# EasyEDA schematic UVsensor (Solarbetrieb).json
TITLE: UVsensor (Solarbetrieb); REV: 0.4; Date: 2019-06-29; Sheet: 1/1; Drawn By: Stefan Burkhardt; Company: Private
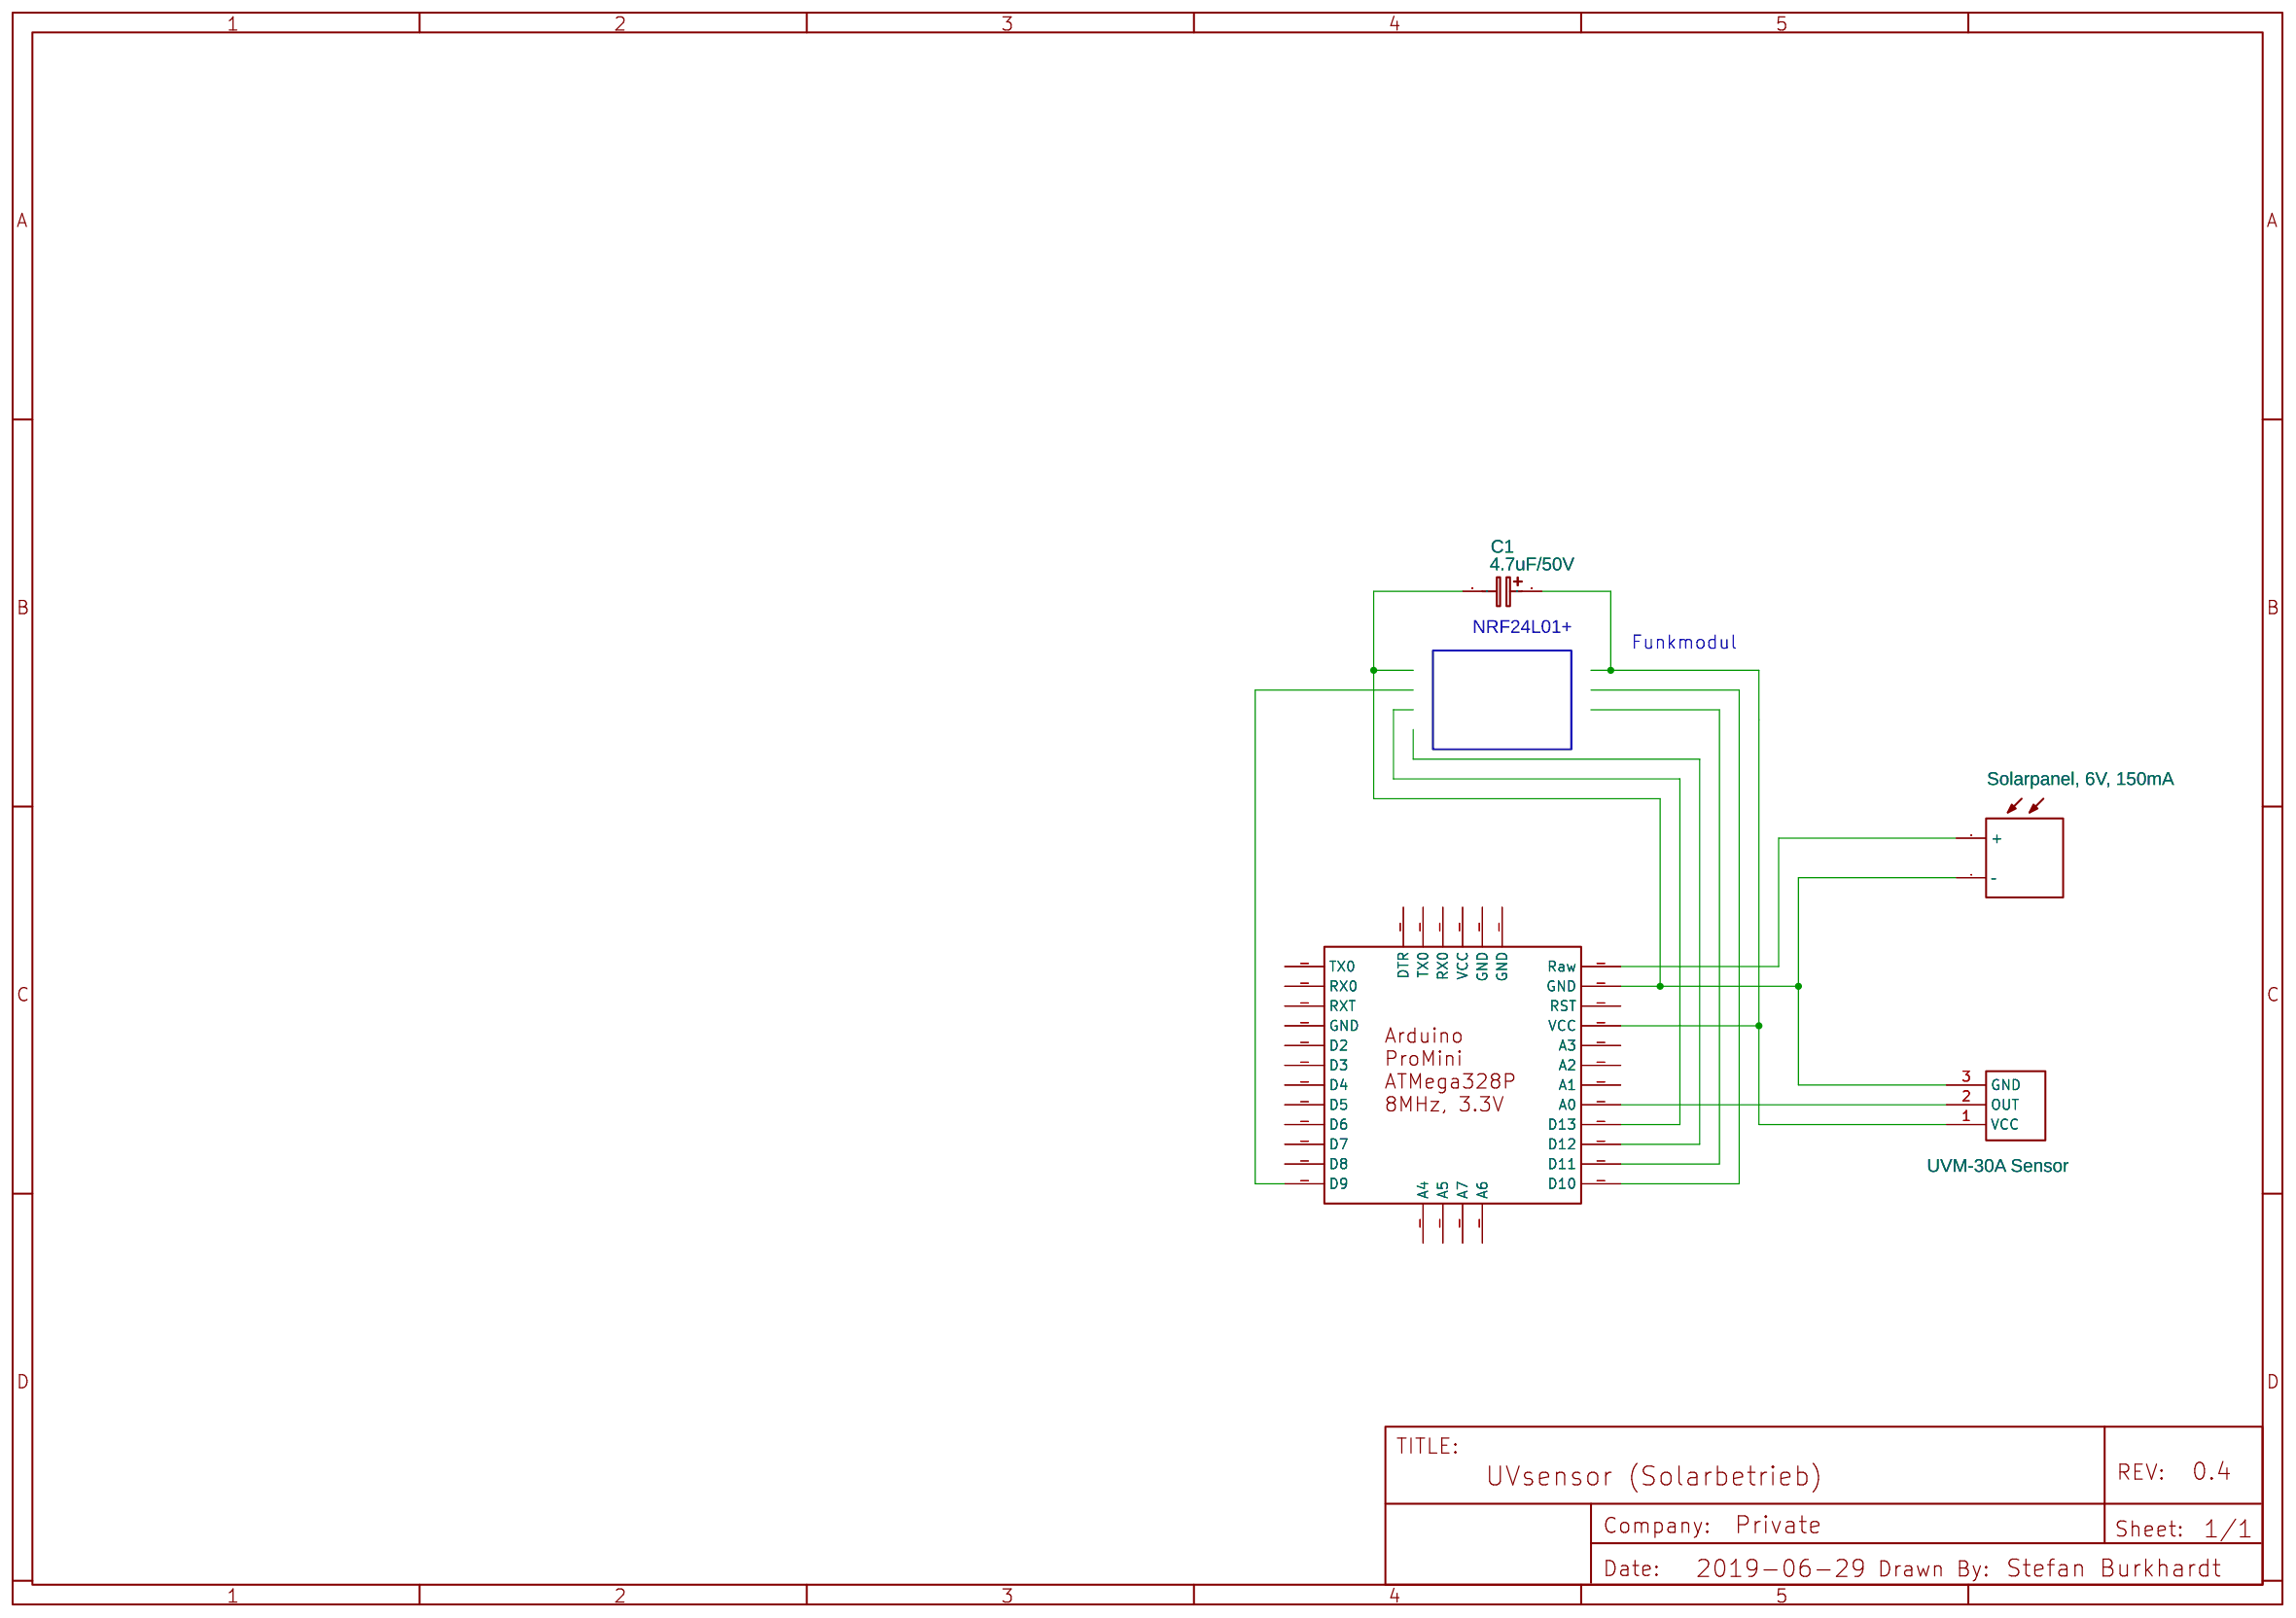
[diagram p0: schematic sheet]

## Parts
C1  4.7uF/50V  [CAP-D3.0XF1.5]
D1  Solarpanel, 6V, 150mA  [LED3MM]
U1  Arduino ProMini ATMega328P 8MHz, 3.3V  [ARDUINO PROMINI3V3]
U2  UVM-30A Sensor

## Library data of the parts
C1 = Cap_Electrolytic(TH)_D3.0XF1.5_EU: Contributor: EasyEDA; Manufacturer Part: ?
D1 = SolarPanel: Manufacturer Part: ?
U1 = -: Manufacturer Part: Arduino ProMini3v3; Contributor: ColorWolf; КОРПУС: https://easyeda.com/editor#id=!d5b057a878e247c8b098473f7093b445
U2 = -: Manufacturer Part: MAX6675; Supplier Part: undefined; Contributor: RealJanis

## Nets
Net-(C1-1): C1.1 C1.2 D1.K(–) U1. (D3) U2.1(VCC) U2.2(OUT) U2.3(GND)

## Notes on the sheet
- NRF24L01+
- Funkmodul
